# Altium schematic sheet MIXED_FILTER.SchDoc: PCB_MIXED_FILTER
size A4; Author: Ravi dusi; SheetNumber: 1; SheetTotal: 1
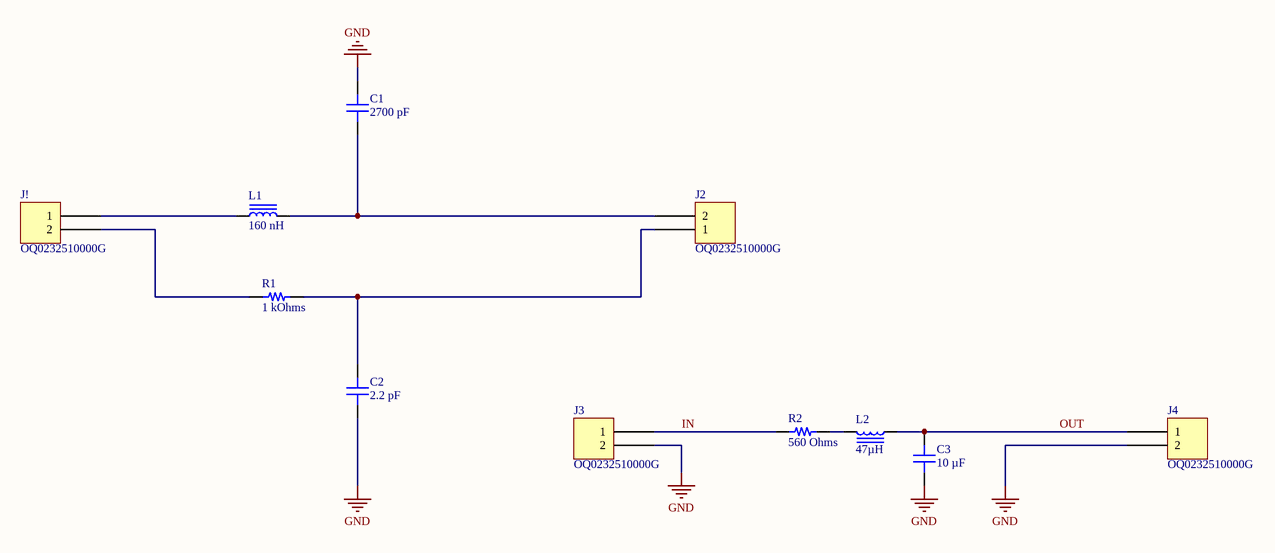
[diagram p0: MIXED_FILTER.SchDoc]

## Parts
C1  2700 pF  [CAP 0603_1608]
C2  2.2 pF  [CAP 0603_1608]
C3  10 µF  [CAP 0603_1608]
J2  OQ0232510000G  [FCI 06-381-2PIN]
J3  OQ0232510000G  [FCI 06-381-2PIN]
J4  OQ0232510000G  [FCI 06-381-2PIN]
J!  OQ0232510000G  [FCI 06-381-2PIN]
L1  160 nH  [IND 0402_1005 RF WW]
L2  47µH  [IND 0603_1608 RF WW]
R1  1 kOhms  [RES 0603_1608]
R2  560 Ohms  [RES 0603_1608]

## Nets
GND: C1.2 C2.2 C3.1 J3.2 J4.2
IN: J3.1 R2.1
OUT: C3.2 J4.1 L2.1
NetC1_1: C1.1 J2.2 L1.2
NetC2_1: C2.1 J2.1 R1.2
NetJ!_1: J!.1 L1.1
NetJ!_2: J!.2 R1.1
NetL2_2: L2.2 R2.2

## Notes on the sheet
- DOCUMENT NAME:
- TITLE:
- This document is created by Mitai. Any further questions can be asked through
- AUTHOR :
- REVIEWER:
- Sheet
- PART NO.:
- of
- *
- DATE:
- TEMPLATE:
- team@mitai.ai.
- A4
- Contact Address:Rosenheimer Straße 116b,81669, München.

## Library data of the parts
C1 = C0603C272F3GAC7867: CAP CER 2700PF 25V NP0 0603; manufacturer: KEMET; Temperature Coefficient: C0G, NP0; Tolerance: ±1%; Part Number: C0603C272F3GAC7867; Value: 2700 pF; Applications: General Purpose; Capacitance: 2700 pF; componentlink1description: Datasheet; componentlink1url: https://api.kemet.com/component-edge/download/datasheet/C0603C272F3GACTU.pdf; componentlink2description: DigiKey Link; componentlink2url: https://www.digikey.com/en/products/detail/kemet/C0603C272F3GAC7867/2200413; Device Package: 0603 (1608 Metric); Features: Low ESL; lastupdated: 03/09/2023 19:08:49; Lifecycle Status: Active; Minimum Order: 1; Mounting Type: Surface Mount, MLCC; Operating Temperature: -55°C ~ 125°C; Package / Case: 0603 (1608 Metric); packaging: TapeAndReel; partid: 2138; Part Status: Active; price: 0.40; series: SMD Comm C0G; Size / Dimension: 0.063" L x 0.031" W (1.60mm x 0.80mm); Supplier 1: DigiKey; Supplier Part Number 1: 399-17403-1-ND; Thickness (Max): 0.034" (0.87mm); Voltage - Rated: 25V
C2 = 600S2R2AT250XT: CAP CER 2.2PF 250V C0G/NP0 0603; manufacturer: American Technical Ceramics; Temperature Coefficient: C0G, NP0; Tolerance: ±0.05pF; Part Number: 600S2R2AT250XT; Value: 2.2 pF; Applications: RF, Microwave, High Frequency, Bypass, Decoupling; Capacitance: 2.2 pF; componentlink1description: Datasheet; componentlink1url: http://www.atceramics.com/UserFiles/600s.pdf; componentlink2description: DigiKey Link; componentlink2url: https://www.digikey.com/en/products/detail/american-technical-ceramics/600S2R2AT250XT/3905215; Device Package: 0603 (1608 Metric); Features: High Q, Low Loss, Ultra Low ESR; lastupdated: 01/11/2023 19:10:24; Lifecycle Status: Active; Minimum Order: 1; Mounting Type: Surface Mount, MLCC; Operating Temperature: -55°C ~ 125°C; Package / Case: 0603 (1608 Metric); packaging: TapeAndReel; partid: 2146; Part Status: Active; price: 0.42; series: ATC 600S; Size / Dimension: 0.063" L x 0.032" W (1.60mm x 0.81mm); Supplier 1: DigiKey; Supplier Part Number 1: 1284-1198-1-ND; Thickness (Max): 0.035" (0.89mm); Voltage - Rated: 250V
C3 = MD0603BW106M100NHT-EM: CAP CER 10UF 10V X5R 0603; manufacturer: Knowles Novacap; Tolerance: ±20%; Part Number: MD0603BW106M100NHT-EM; Value: 10 µF; Applications: Medical, Non-Critical; Capacitance: 10 µF; componentlink1description: Datasheet; componentlink1url: https://mm.digikey.com/Volume0/opasdata/d220001/medias/docus/5546/MD Series R3.pdf; componentlink2description: DigiKey Link; componentlink2url: https://www.digikey.com/en/products/detail/knowles-novacap/MD0603BW106M100NHT-EM/21406876; Device Package: 0603 (1608 Metric); lastupdated: 02/11/2023 19:09:18; Lifecycle Status: Active; Minimum Order: 1; Mounting Type: Surface Mount, MLCC; Operating Temperature: -55°C ~ 85°C; Package / Case: 0603 (1608 Metric); packaging: TapeAndReel; partid: 56748; price: 0.24; series: MD; Supplier 1: DigiKey; Supplier Part Number 1: 1763-MD0603BW106M100NHT-EMCT-ND; Temperature Coefficient: X5R; Voltage - Rated: 10V
J2-J4 J! = OQ0232510000G: TERM BLOCK HDR 2POS 90DEG 3.81MM; Manufacturer: Amphenol Anytek; Current - UL: 10A; Header Orientation: 90°, Right Angle; Number of Levels: 1; Number of Positions: 2; Pitch: 0.150" (3.81mm); Voltage - UL: 300V; Part Number: OQ0232510000G; Color: Green; ComponentLink1Description: Datasheet; ComponentLink1URL: http://portal.fciconnect.com/Comergent//fci/drawing/oqxx32x100j0g.pdf; ComponentLink2Description: DigiKey Link; ComponentLink2URL: //digikey.com/product-detail/en/amphenol-anytek/OQ0232510000G/609-3819-ND/2261255; Contact Mating Finish: Tin; LastUpdated: 16/12/2019 19:14:30; Lifecycle Status: 0; Minimum Order: 1; Mounting Type: Through Hole; Operating Temperature: -40°C ~ 115°C; Packaging: Bulk; Part Status: Active; Positions Per Level: 2; Price: 0.49; Series: 06-381; Supplier 1: DigiKey; Supplier Part Number 1: 609-3819-ND; Termination Style: Solder; Type: Header, Male Pins, Shrouded (4 Side)
L1 = LQW15CNR16J00D: FIXED IND 160NH 480MA 330MOHM SM; Manufacturer: Murata Electronics; DC Resistance (DCR): 330mOhm Max; Frequency - Self Resonant: 900MHz; Inductance Frequency - Test: 100 MHz; Material - Core: Ferrite; Shielding: Unshielded; Tolerance: ±5%; Type: Drum Core, Wirewound; Part Number: LQW15CNR16J00D; ComponentLink1Description: Datasheet; ComponentLink1URL: https://search.murata.co.jp/Ceramy/image/img/P02/JELF243A-0087.pdf; ComponentLink2Description: DigiKey Link; ComponentLink2URL: https://www.digikey.com/en/products/detail/murata-electronics/LQW15CNR16J00D/4359664; Current Rating (Amps): 480 mA; Device Package: 0402 (1005 Metric); Height - Seated (Max): 0.024" (0.60mm); Inductance: 160 nH; LastUpdated: 03/09/2023 20:25:06; Lifecycle Status: Active; Minimum Order: 1; Mounting Type: Surface Mount; Operating Temperature: -55°C ~ 125°C; Package / Case: 0402 (1005 Metric); Packaging: TapeAndReel; PartId: 1; Part Status: Active; Price: 0.19; Series: LQW15; Size / Dimension: 0.039" L x 0.024" W (1.00mm x 0.60mm); Supplier 1: DigiKey; Supplier Part Number 1: 490-14716-1-ND; Value: 160 nH
L2 = L0603B470MPWFT: INDUCTORPOWER LINE 0603 47H 20%; Manufacturer: KEMET; Current Rating (Amps): 90mA; DC Resistance (DCR): 5.8Ohm; Frequency - Self Resonant: 11MHz; Inductance Frequency - Test: 2.52MHz; Material - Core: Ferrite; Shielding: Unshielded; Type: Wirewound; Part Number: L0603B470MPWFT; ComponentLink1Description: Datasheet; ComponentLink1URL: https://api.kemet.com/component-edge/download/datasheet/L0603B470MPWFT.pdf; ComponentLink2Description: DigiKey Link; ComponentLink2URL: http://digikey.com/product-detail/en/kemet/L0603B470MPWFT/399-17776-1-ND/8601439; Device Package: 0603 (1608 Metric); Height - Seated (Max): 0.035" (0.90mm); Inductance: 47µH; LastUpdated: 06/09/2020 11:05:20; Lifecycle Status: Active; Minimum Order: 1; Mounting Type: Surface Mount; Operating Temperature: -40°C ~ 105°C; Package / Case: 0603 (1608 Metric); Packaging: TapeAndReel; PartId: 1309; Part Status: Active; Price: 0.14; Series: L-PWF; Size / Dimension: 0.063" L x 0.031" W (1.60mm x 0.80mm); Supplier 1: DigiKey; Supplier Part Number 1: 399-17776-1-ND; Supplier Device Package: 0603 (1608 Metric); Tolerance: ±20%; Value: 47µH
R1 = CPF0603B1K0E: RES SMD 1K OHM 0.1% 1/16W 0603; Manufacturer: TE Connectivity Passive Product; Power (Watts): 0.063W, 1/16W; Temperature Coefficient: ±25ppm/°C; Part Number: CPF0603B1K0E; Value: 1 kOhms; ComponentLink1Description: Datasheet; ComponentLink1URL: https://www.te.com/commerce/DocumentDelivery/DDEController?Action=srchrtrv&DocNm=1773200&DocType=DS&DocLang=English; ComponentLink2Description: DigiKey Link; ComponentLink2URL: https://www.digikey.com/en/products/detail/te-connectivity-passive-product/CPF0603B1K0E/2390473; Composition: Thin Film; Device Package: 0603 (1608 Metric); Height - Seated (Max): 0.022" (0.55mm); LastUpdated: 01/11/2023 19:40:18; Lifecycle Status: Active; Minimum Order: 1; Number of Terminations: 2; Operating Temperature: -55°C ~ 155°C; Package / Case: 0603 (1608 Metric); Packaging: TapeAndReel; PartId: 4877; Part Status: Active; Price: 0.09; Resistance: 1 kOhms; Series: CPF, Neohm; Size / Dimension: 0.061" L x 0.031" W (1.55mm x 0.80mm); Supplier 1: DigiKey; Supplier Part Number 1: A119887CT-ND; Supplier Device Package: 0603; Tolerance: ±0.1%
R2 = CRGP0603F560R: RES 560 OHM 1% 1/4W 0603; Manufacturer: TE Connectivity Passive Product; Power (Watts): 0.25W, 1/4W; Temperature Coefficient: ±100ppm/°C; Part Number: CRGP0603F560R; Value: 560 Ohms; ComponentLink1Description: Datasheet; ComponentLink1URL: https://www.te.com/commerce/DocumentDelivery/DDEController?Action=srchrtrv&DocNm=9-1773463-9&DocType=DS&DocLang=English; ComponentLink2Description: DigiKey Link; ComponentLink2URL: https://www.digikey.com/en/products/detail/te-connectivity-passive-product/CRGP0603F560R/8577015; Composition: Thick Film; Device Package: 0603 (1608 Metric); Features: Pulse Withstanding; Height - Seated (Max): 0.022" (0.55mm); LastUpdated: 02/11/2023 19:45:35; Lifecycle Status: Active; Minimum Order: 1; Number of Terminations: 2; Operating Temperature: -55°C ~ 155°C; Package / Case: 0603 (1608 Metric); Packaging: TapeAndReel; PartId: 4997; Part Status: Active; Price: 0.02; Resistance: 560 Ohms; Series: CRGP; Size / Dimension: 0.063" L x 0.031" W (1.60mm x 0.80mm); Supplier 1: DigiKey; Supplier Part Number 1: A130413CT-ND; Supplier Device Package: 0603; Tolerance: ±1%